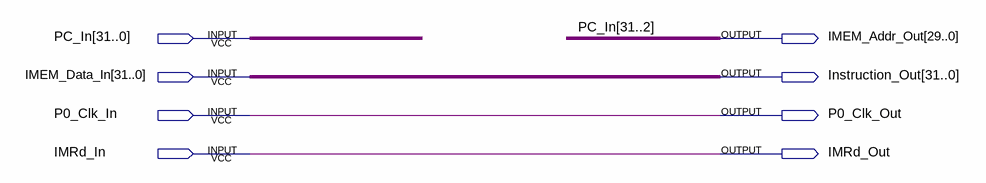
[diagram p0: schematic sheet]
// Quartus schematic IBIU.bdf as structural Verilog: 0 symbols, 8 pins
module IBIU (
  input  [31:0] PC_In,
  input  [31:0] IMEM_Data_In,
  input  P0_Clk_In,
  input  IMRd_In,
  output [29:0] IMEM_Addr_Out,
  output [31:0] Instruction_Out,
  output P0_Clk_Out,
  output IMRd_Out
);


  assign IMEM_Addr_Out = PC_In[31:2];
  assign IMRd_Out = IMRd_In;
  assign Instruction_Out = IMEM_Data_In;
  assign P0_Clk_Out = P0_Clk_In;
endmodule
